# Altium schematic sheet OBC_Flash.SchDoc: Flash
size A4; SheetNumber: 9; SheetTotal: 10
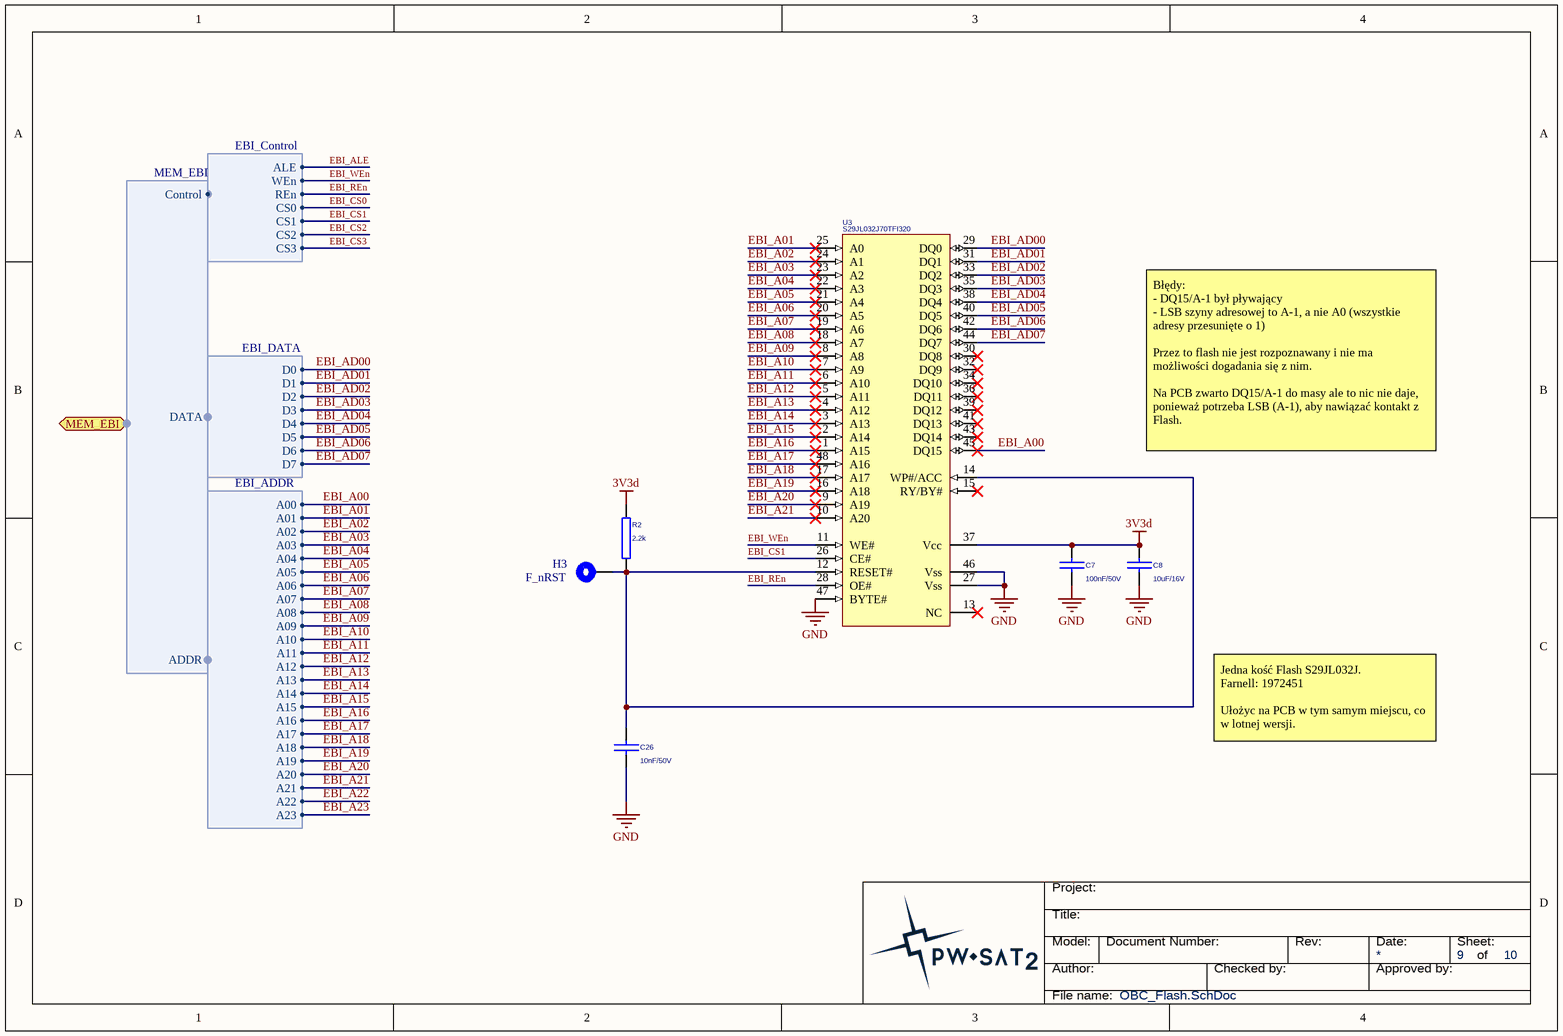
[diagram p0: OBC_Flash.SchDoc]

## Parts
C7  100nF/50V  [C0603]
C8  10uF/16V  [C1206]
C26  10nF/50V  [C0603]
H3  F_nRST  [TESTPOINT]  (no BOM)
R2  2.2k  [R0603]
U3  S29JL032J70TFI320  [TSSOP50P2000X125-48N]

## Ports
MEM_EBI (harness MEM_EBI)

## Harnesses
EBI_Control: ALE, WEn, REn, CS0, CS1, CS2, CS3
MEM_EBI: DATA, ADDR, Control
EBI_DATA: D6, D5, D4, D3, D2, D1, D0, D7
EBI_ADDR: A09, A10, A11, A12, A13, A14, A15, A08, A16, A17, A18, A19, A20, A21, A22, A23, A00, A01, A02, A03, A04, A05, A06, A07

## Nets
3V3d: C7.1 C8.1 R2.2 U3.37(Vcc)
GND: C7.2 C8.2 C26.2 U3.27(Vss) U3.46(Vss) U3.47(BYTE#)
EBI_A00: U3.45(DQ15) ; harness EBI_ADDR.A00
EBI_A01: U3.25(A0) ; harness EBI_ADDR.A01
EBI_A02: U3.24(A1) ; harness EBI_ADDR.A02
EBI_A03: U3.23(A2) ; harness EBI_ADDR.A03
EBI_A04: U3.22(A3) ; harness EBI_ADDR.A04
EBI_A05: U3.21(A4) ; harness EBI_ADDR.A05
EBI_A06: U3.20(A5) ; harness EBI_ADDR.A06
EBI_A07: U3.19(A6) ; harness EBI_ADDR.A07
EBI_A08: U3.18(A7) ; harness EBI_ADDR.A08
EBI_A09: U3.8(A8) ; harness EBI_ADDR.A09
EBI_A10: U3.7(A9) ; harness EBI_ADDR.A10
EBI_A11: U3.6(A10) ; harness EBI_ADDR.A11
EBI_A12: U3.5(A11) ; harness EBI_ADDR.A12
EBI_A13: U3.4(A12) ; harness EBI_ADDR.A13
EBI_A14: U3.3(A13) ; harness EBI_ADDR.A14
EBI_A15: U3.2(A14) ; harness EBI_ADDR.A15
EBI_A16: U3.1(A15) ; harness EBI_ADDR.A16
EBI_A17: U3.48(A16) ; harness EBI_ADDR.A17
EBI_A18: U3.17(A17) ; harness EBI_ADDR.A18
EBI_A19: U3.16(A18) ; harness EBI_ADDR.A19
EBI_A20: U3.9(A19) ; harness EBI_ADDR.A20
EBI_A21: U3.10(A20) ; harness EBI_ADDR.A21
EBI_A22: harness EBI_ADDR.A22
EBI_A23: harness EBI_ADDR.A23
EBI_AD00: U3.29(DQ0) ; harness EBI_DATA.D0
EBI_AD01: U3.31(DQ1) ; harness EBI_DATA.D1
EBI_AD02: U3.33(DQ2) ; harness EBI_DATA.D2
EBI_AD03: U3.35(DQ3) ; harness EBI_DATA.D3
EBI_AD04: U3.38(DQ4) ; harness EBI_DATA.D4
EBI_AD05: U3.40(DQ5) ; harness EBI_DATA.D5
EBI_AD06: U3.42(DQ6) ; harness EBI_DATA.D6
EBI_AD07: U3.44(DQ7) ; harness EBI_DATA.D7
EBI_ALE: harness EBI_Control.ALE
EBI_CS0: harness EBI_Control.CS0
EBI_CS1: U3.26(CE#) ; harness EBI_Control.CS1
EBI_CS2: harness EBI_Control.CS2
EBI_CS3: harness EBI_Control.CS3
EBI_REn: U3.28(OE#) ; harness EBI_Control.REn
EBI_WEn: U3.11(WE#) ; harness EBI_Control.WEn
NetC26_1: C26.1 H3.1 R2.1 U3.12(RESET#) U3.14(WP#/ACC)

Not connected (* = marked no-connect by the designer): U3 13(NC)* 15(RY/BY#)* 30(DQ8)* 32(DQ9)* 34(DQ10)* 36(DQ11)* 39(DQ12)* 41(DQ13)* 43(DQ14)*

## Notes on the sheet
- Błędy:
  - DQ15/A-1 był pływający
  - LSB szyny adresowej to A-1, a nie A0 (wszystkie adresy przesunięte o 1)
  Przez to flash nie jest rozpoznawany i nie ma możliwości dogadania się z nim.
  Na PCB zwarto DQ15/A-1 do masy ale to nic nie daje, ponieważ potrzeba LSB (A-1), aby nawiązać kontakt z Flash.
- Jedna kość Flash S29JL032J.
  Farnell: 1972451
  Ułożyc na PCB w tym samym miejscu, co w lotnej wersji.
- Title:
- Project:
- Author:
- Model:
- Document Number:
- Checked by:
- Rev:
- Date:
- Approved by:
- Sheet:
- of
- File name:

## Library data of the parts
C7 = CAP: Capacitator; Voltage: 50V; Material: X7R; Value: 100nF; Farnell: 1759122; Supplier Part Number 1: 1759122; Supplier 1: Farnell
C8 = CAP: Capacitator; Voltage: 16V; Material: X5R; Value: 10uF; Farnell: 2320922; Supplier Part Number 1: 2320922; Supplier 1: Farnell
C26 = CAP: Capacitator; Voltage: 50V; Material: X7R; Value: 10nF; Farnell: 9406182; Supplier Part Number 1: 9406182; Supplier 1: Farnell
H3 = Wire_AWG-30: An AWG-30 wire solder point.
R2 = RES: Resistor; Tolerance: 1%; Farnell: 9330810; Value: 2.2k; Supplier Part Number 1: 9330810; Supplier 1: Farnell
U3 = S29JL032J: IC FLASH 32MBIT 70NS 48TSOP; Manufacturer: Cypress Semiconductor; partNo: S29JL032J70TFI320; DigiKey: S29JL032J70TFI320-ND; Supplier 1: Digi-Key